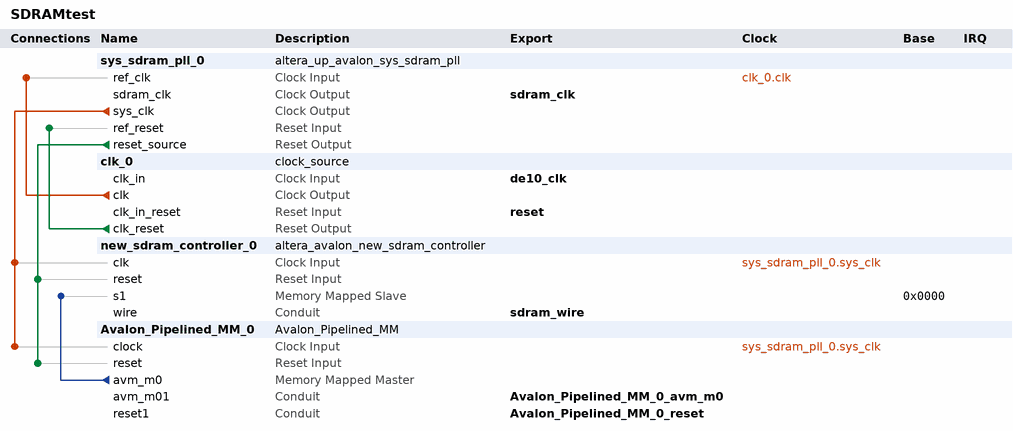
[diagram p0: system contents]
# Platform Designer (Qsys) system SDRAMtest, MAX 10 10M50DAF484C7G
# Parameters at their usual value, and those the tool derives, are not listed.
package require -exact qsys 20.1
create_system SDRAMtest
set_project_property DEVICE_FAMILY {MAX 10}
set_project_property DEVICE 10M50DAF484C7G

add_instance sys_sdram_pll_0 altera_up_avalon_sys_sdram_pll 18.0
set_instance_parameter_value sys_sdram_pll_0 CV_boards DE10-Standard
set_instance_parameter_value sys_sdram_pll_0 gui_outclk 50.0
set_instance_parameter_value sys_sdram_pll_0 gui_refclk 50.0

add_instance clk_0 clock_source 20.1
set_instance_parameter_value clk_0 clockFrequency 50000000

add_instance new_sdram_controller_0 altera_avalon_new_sdram_controller 20.1
set_instance_parameter_value new_sdram_controller_0 TAC 6.0
set_instance_parameter_value new_sdram_controller_0 TRCD 15.0
set_instance_parameter_value new_sdram_controller_0 TRFC 55.0
set_instance_parameter_value new_sdram_controller_0 TRP 15.0
set_instance_parameter_value new_sdram_controller_0 casLatency 2
set_instance_parameter_value new_sdram_controller_0 columnWidth 10
set_instance_parameter_value new_sdram_controller_0 dataWidth 16
set_instance_parameter_value new_sdram_controller_0 generateSimulationModel false
set_instance_parameter_value new_sdram_controller_0 initRefreshCommands 8
set_instance_parameter_value new_sdram_controller_0 model single_Micron_MT48LC4M32B2_7_chip
set_instance_parameter_value new_sdram_controller_0 numberOfBanks 4
set_instance_parameter_value new_sdram_controller_0 numberOfChipSelects 1
set_instance_parameter_value new_sdram_controller_0 powerUpDelay 100.0
set_instance_parameter_value new_sdram_controller_0 refreshPeriod 7.8125
set_instance_parameter_value new_sdram_controller_0 rowWidth 13

add_instance Avalon_Pipelined_MM_0 Avalon_Pipelined_MM 1.0

# connections
add_connection clk_0.clk sys_sdram_pll_0.ref_clk clock
add_connection sys_sdram_pll_0.sys_clk Avalon_Pipelined_MM_0.clock clock
add_connection sys_sdram_pll_0.sys_clk new_sdram_controller_0.clk clock
add_connection clk_0.clk_reset sys_sdram_pll_0.ref_reset reset
add_connection sys_sdram_pll_0.reset_source Avalon_Pipelined_MM_0.reset reset
add_connection sys_sdram_pll_0.reset_source new_sdram_controller_0.reset reset
add_connection Avalon_Pipelined_MM_0.avm_m0 new_sdram_controller_0.s1 avalon
set_connection_parameter_value Avalon_Pipelined_MM_0.avm_m0/new_sdram_controller_0.s1 baseAddress 0x0000

# exported interfaces
add_interface Avalon_Pipelined_MM_0_avm_m0 conduit end
set_interface_property Avalon_Pipelined_MM_0_avm_m0 EXPORT_OF Avalon_Pipelined_MM_0.avm_m01
add_interface Avalon_Pipelined_MM_0_reset conduit end
set_interface_property Avalon_Pipelined_MM_0_reset EXPORT_OF Avalon_Pipelined_MM_0.reset1
add_interface de10_clk clock sink
set_interface_property de10_clk EXPORT_OF clk_0.clk_in
add_interface reset reset sink
set_interface_property reset EXPORT_OF clk_0.clk_in_reset
add_interface sdram_clk clock source
set_interface_property sdram_clk EXPORT_OF sys_sdram_pll_0.sdram_clk
add_interface sdram_wire conduit end
set_interface_property sdram_wire EXPORT_OF new_sdram_controller_0.wire

set_interconnect_requirement {$system} qsys_mm.clockCrossingAdapter HANDSHAKE
set_interconnect_requirement {$system} qsys_mm.enableEccProtection FALSE
set_interconnect_requirement {$system} qsys_mm.insertDefaultSlave FALSE
set_interconnect_requirement {$system} qsys_mm.maxAdditionalLatency 1

save_system SDRAMtest.qsys
